# Altium schematic sheet Buck Converter 3.3V.SchDoc
size A; SheetNumber: 3; SheetTotal: 3
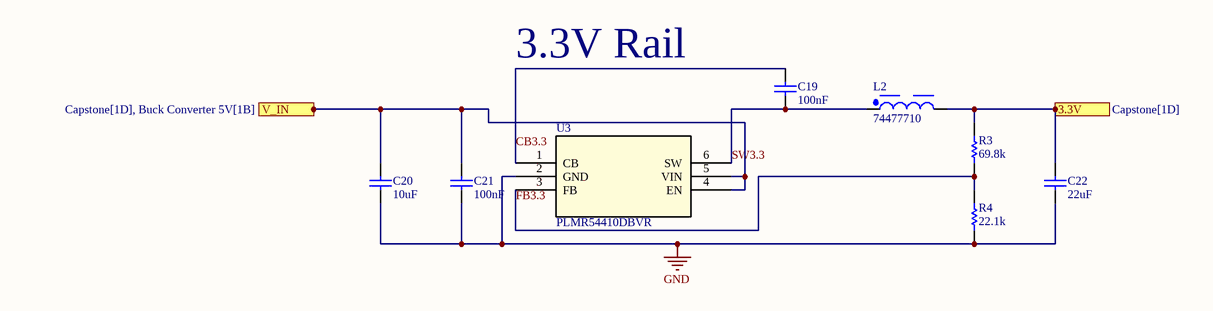
[diagram p0: Buck Converter 3.3V.SchDoc]

## Parts
C19  100nF  [CAPC2013X135X45LL10T25]
C20  10uF  [CAPC2013X135X45LL10T25]
C21  100nF  [CAPC2013X135X45LL10T25]
C22  22uF  [CAPC2013X135X45LL10T25]
L2  74477710  [WE-PD_7345]
R3  69.8k  [RESC1608X55X25ML10T15]
R4  22.1k  [RESC1608X55X25ML10T15]
U3  PLMR54410DBVR  [U_SOT-23_TEX]

## Ports
3.3V (out, see Capstone[1D]), V_IN (in, see Capstone[1D], Buck Converter 5V[1B])

## Nets
GND: C20.1 C21.1 C22.1 R4.1 U3.2(GND)
3.3V: C22.2 L2.2 R3.2 ; port 3.3V
CB3.3: C19.2 U3.1(CB)
FB3.3: R3.1 R4.2 U3.3(FB)
SW3.3: C19.1 L2.1 U3.6(SW)
V_IN: C20.2 C21.2 U3.4(EN) U3.5(VIN) ; port V_IN

## Notes on the sheet
- 3.3V Rail

## Library data of the parts
C19-C22 = CMP-1662-00015-2: Chip Capacitor, 4.7 uF, +/- 10%, 16 V, -55 to 85 degC, 0805 (2012 Metric), RoHS, Tape and Reel; PartNumber: GRM21BR61C475KA88L; Voltage Rating (DC): 16 V; Capacitance: 4.7 uF; Type (Capacitors): X5R; Case\/Package: 0805; Pins: 2; DatasheetVersion: 03/2016; REACH SVHC: No SVHC; Tolerance: 10%; Width: 1.25 mm; Mount: Surface Mount; ComponentLink1Description: Manufacturer URL; Case Code (Metric): 2012; PackageDescription: 2-Pin Surface Mount Device, Body 2 x 1.25 mm; Height: 1.25 mm; Voltage Rating: 16 V; Max Operating Temperature: 85 degC; RoHSCompliant: true; Length: 2 mm; ComponentLink1URL: http://www.murata.com/; Mounting Technology: Surface Mount; Packaging: Tape and Reel; Min Operating Temperature: -55 degC; ComponentLink2Description: Datasheet; Case Code (Imperial): 0805; Radiation Hardening: No; Package Quantity: 3000; PackageReference: 0805; ComponentLink2URL: http://search.murata.co.jp/Ceramy/image/img/A01X/G101/ENG/GRM21BR61C475KA88-01.pdf
L2 = CMP-0227-00113-2: NexarPartId: 11853718; Saturation Current: 2.6A; Current Rating: 2A; DC Resistance (DCR): 45mΩ; Inductance Tolerance: 20%; Core Material: Ferrite; Shielding: Shielded; Test Frequency: 1kHz; Inductance: 10µH; Self Resonant Frequency: 23MHz; RoHS: Compliant; Ambient Temperature Range Low: -40°C; Case/Package: Nonstandard; Composition: Wirewound; Height - Seated (Max): 4.4958mm; Mount: Surface Mount; Max DC Current: 2A; Length: 7.3mm; Termination: SMD/SMT; Depth: 7.3mm; Lead Pitch: 4mm; Ambient Temperature Range High: 85°C; Max Operating Temperature: 125°C; Width: 7.3mm; Lead Free: Lead Free; Min Operating Temperature: -40°C; Tolerance: 20%; Packaging: Cut Tape (CT); Number of Pins: 2; Height: 4.5mm
R3 R4 = CMP-2100-03667-1: Chip Resistor, 0 Ohm, +/- 5%, 0.1 W, -55 to 155 degC, 0603 (1608 Metric), RoHS, Tape and Reel; Manufacturer: Yageo; Temperature Coefficient: 200ppm/degreesC; Voltage Rating: 50V; Power Rating: 100mW; Resistance: 0mOhm; Width: 0.8mm; Max Operating Temperature: 155degC; Tolerance: 5%; Package Reference: 0603; Height: 0.45mm; Depth: 0.8mm; Package Description: 2-Pin Surface Mount Device, Body 1.6 x 0.8 mm; Termination: SMD/SMT; Package Quantity: 5000; Case/Package: 0603; Case Code (Imperial): 0603; Radiation Hardening: No; Number of Pins: 2; Length: 1.6mm; Lead Free: LeadFree; Voltage Rating (DC): 50V; Military Standard: Not; Datasheet URL: http://www.yageo.com/NewPortal/yageodocoutput?fileName=/pdf/R-Chip/PYu-RC_Group_51_RoHS_L_5.pdf; Manufacturer URL: http://www.yageo.com/; Packaging: TapeandReel; Case Code (Metric): 1608; Min Operating Temperature: -55degC; Composition: ThickFilm; RoHSCompliant: true; Contact Plating: Tin; Datasheet Version: Rev. 5, 10/2016; REACH SVHC: NoSVHC
U3 = PLMR54410DBVR: No Description Available; Mfr_Name: Texas Instruments; RefDes: RefDes; Type: Type